# EAGLE design F-rev04 (EAGLE 9.6.2)
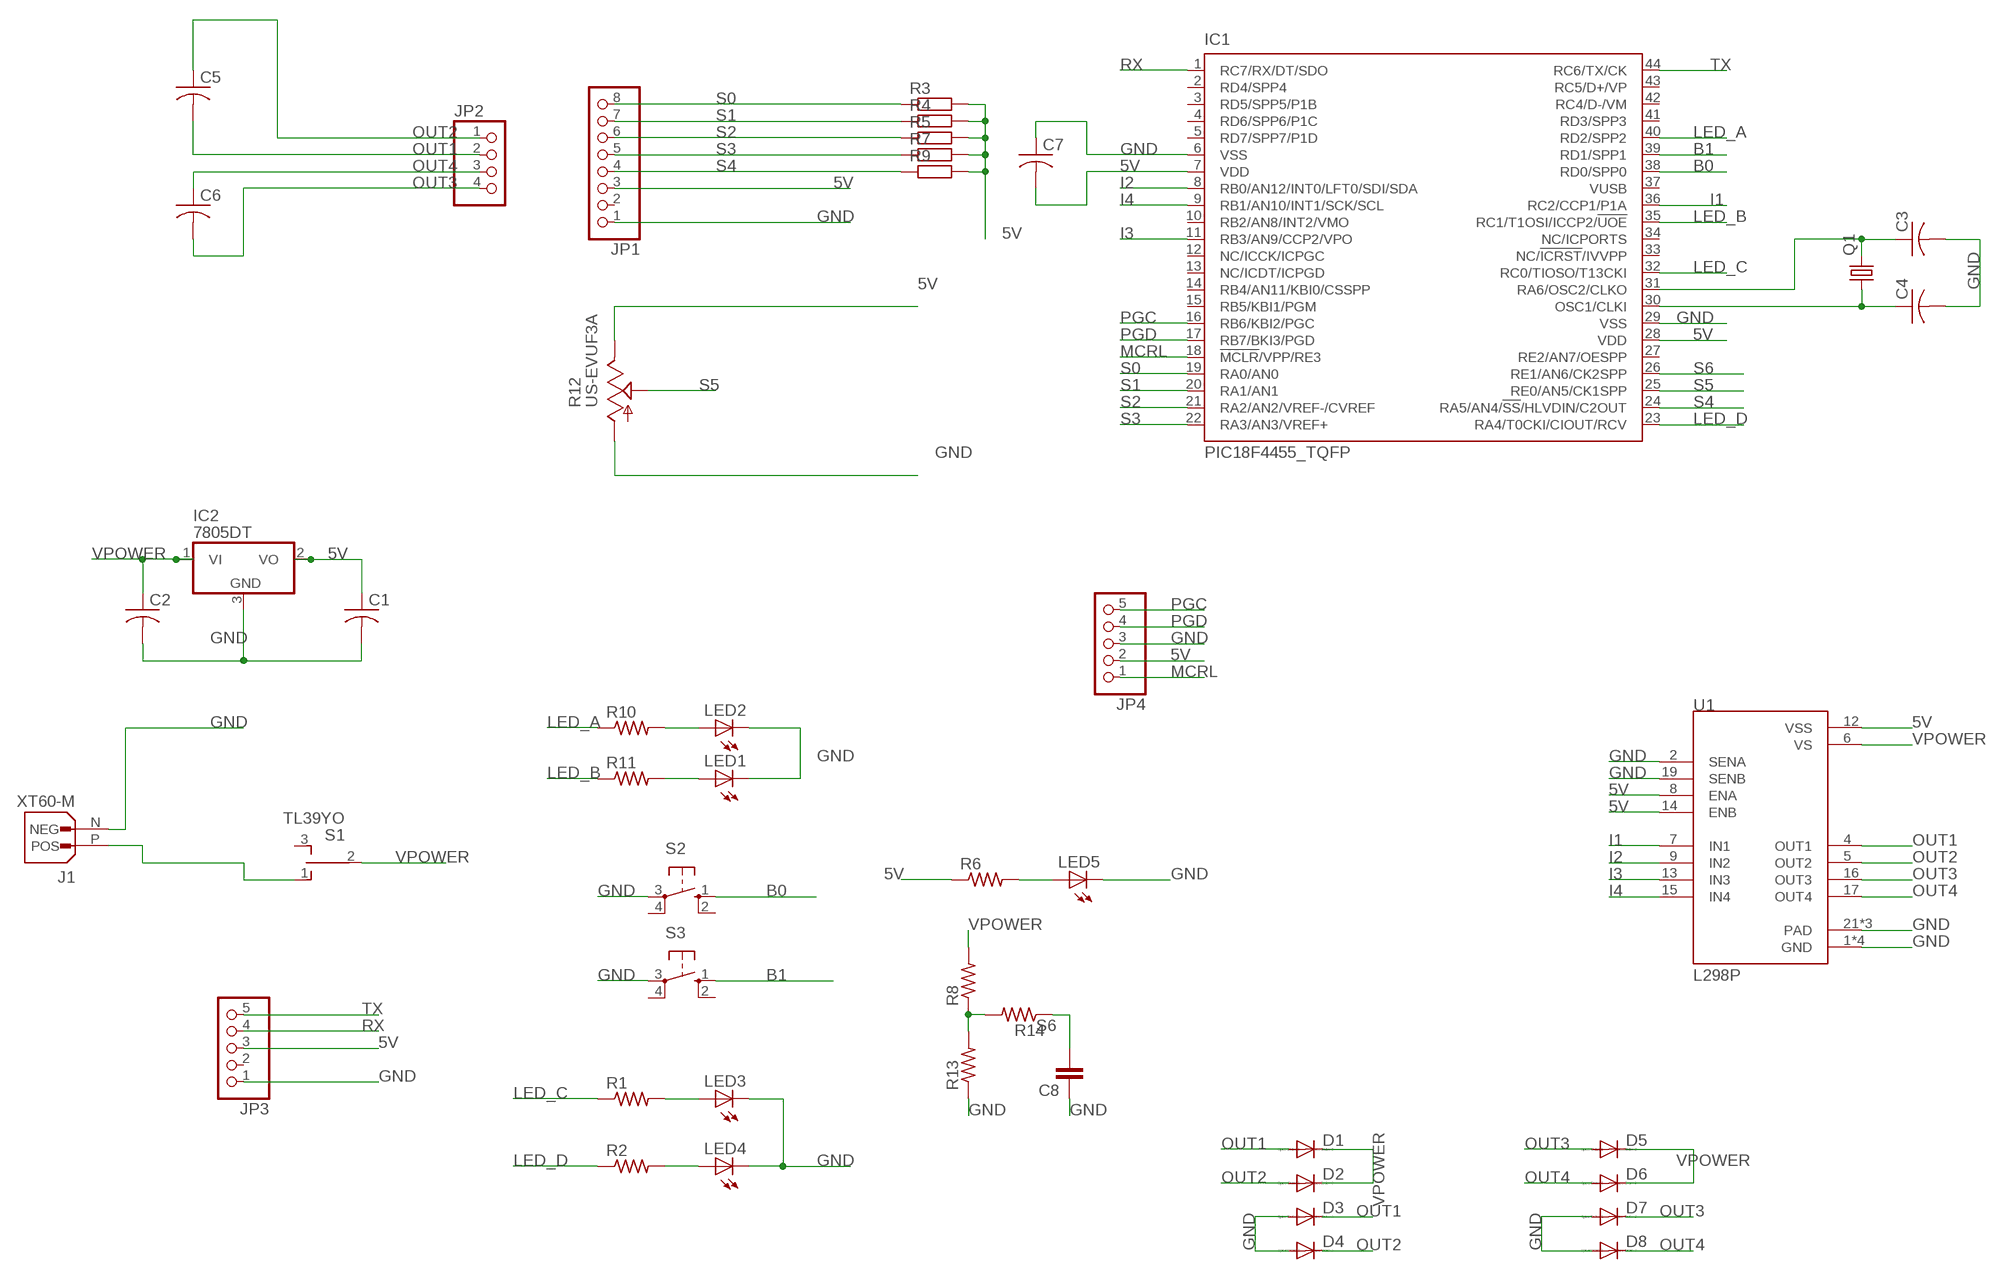
[diagram p0: schematic, sheet 1]

## Parts
C1  C-USC0805K  [C0805K]
C2  C-USC0805K  [C0805K]
C3  C-USC0805K  [C0805K]
C4  C-USC0805K  [C0805K]
C5  C-USC0805K  [C0805K]
C6  C-USC0805K  [C0805K]
C7  C-USC0805K  [C0805K]
C8  C2,5-3  [C2.5-3]
D1  DIODE-DO214AC  [DO214AC]
D2  DIODE-DO214AC  [DO214AC]
D3  DIODE-DO214AC  [DO214AC]
D4  DIODE-DO214AC  [DO214AC]
D5  DIODE-DO214AC  [DO214AC]
D6  DIODE-DO214AC  [DO214AC]
D7  DIODE-DO214AC  [DO214AC]
D8  DIODE-DO214AC  [DO214AC]
IC1  PIC18F4455_TQFP  [TQFP44]
IC2  7805DT  [TO252]
J1  XT60-M  [AMASS_XT60-M]
JP1  PINHD-1X8  [1X08]
JP2  PINHD-1X4  [1X04]
JP3  PINHD-1X5  [1X05]
JP4  PINHD-1X5  [1X05]
LED1  LEDCHIPLED_1206  [CHIPLED_1206]
LED2  LEDCHIPLED_1206  [CHIPLED_1206]
LED3  LEDCHIPLED_1206  [CHIPLED_1206]
LED4  LEDCHIPLED_1206  [CHIPLED_1206]
LED5  LEDCHIPLED_1206  [CHIPLED_1206]
Q1  CRYSTALHC49S  [HC49/S]
R1  R-US_R0805  [R0805]
R2  R-US_R0805  [R0805]
R3  R-EU_M0805  [M0805]
R4  R-EU_M0805  [M0805]
R5  R-EU_M0805  [M0805]
R6  R-US_M0805  [M0805]
R7  R-EU_M0805  [M0805]
R8  R-US_M0805  [M0805]
R9  R-EU_M0805  [M0805]
R10  R-US_M0805  [M0805]
R11  R-US_M0805  [M0805]
R12  US-EVUF3A  [EVUF]
R13  R-US_M0805  [M0805]
R14  R-US_M0805  [M0805]
S1  TL39YO  [TL3XYO]
S2  10-XX  [B3F-10XX]
S3  10-XX  [B3F-10XX]
U1  L298P  [SOIC127P1420X360-20N]

## Nets
5V: C1.1 C7.2 IC1.7(VDD) IC1.28(VDD) IC2.2(VO) JP1.3 JP3.3 JP4.2 R3.2 R4.2 R5.2 R6.1 R7.2 R9.2 R12.3(E) U1.8(ENA) U1.12(VSS) U1.14(ENB)
B0: IC1.38(RD0/SPP0) S2.1(S)
B1: IC1.39(RD1/SPP1) S3.1(S)
GND: C1.2 C2.2 C3.2 C4.2 C7.1 C8.1 D3.A D4.A D7.A D8.A IC1.6(VSS) IC1.29(VSS) IC2.3(GND) J1.N(NEG) JP1.1 JP3.1 JP4.3 LED1.C LED2.C LED3.C LED4.C LED5.C R12.1(A) R13.1 S2.3(P) S3.3(P) U1.1(GND) U1.2(SENA) U1.10(GND) U1.11(GND) U1.19(SENB) U1.20(GND) U1.21(PAD) U1.22(PAD) U1.23(PAD)
I1: IC1.36(RC2/CCP1/P1A) U1.7(IN1)
I2: IC1.8(RB0/AN12/INT0/LFT0/SDI/SDA) U1.9(IN2)
I3: IC1.11(RB3/AN9/CCP2/VPO) U1.13(IN3)
I4: IC1.9(RB1/AN10/INT1/SCK/SCL) U1.15(IN4)
LED_A: IC1.40(RD2/SPP2) R10.1
LED_B: IC1.35(RC1/T1OSI/ICCP2/!UOE) R11.1
LED_C: IC1.32(RC0/TIOSO/T13CKI) R1.1
LED_D: IC1.23(RA4/T0CKI/CIOUT/RCV) R2.1
MCRL: IC1.18(!MCLR!/VPP/RE3) JP4.1
N$17: C4.1 IC1.30(OSC1/CLKI) Q1.1
N$18: C3.1 IC1.31(RA6/OSC2/CLKO) Q1.2
N$19: R8.1 R13.2 R14.2
N$20: LED2.A R10.2
N$21: LED1.A R11.2
N$24: LED3.A R1.2
N$25: LED4.A R2.2
N$26: LED5.A R6.2
OUT1: C5.2 D1.A D3.C JP2.2 U1.4(OUT1)
OUT2: C5.1 D2.A D4.C JP2.1 U1.5(OUT2)
OUT3: C6.2 D5.A D7.C JP2.4 U1.16(OUT3)
OUT4: C6.1 D6.A D8.C JP2.3 U1.17(OUT4)
PGC: IC1.16(RB6/KBI2/PGC) JP4.5
PGD: IC1.17(RB7/BKI3/PGD) JP4.4
RX: IC1.1(RC7/RX/DT/SDO) JP3.4
S0: IC1.19(RA0/AN0) JP1.8 R3.1
S1: IC1.20(RA1/AN1) JP1.7 R4.1
S2: IC1.21(RA2/AN2/VREF-/CVREF) JP1.6 R5.1
S3: IC1.22(RA3/AN3/VREF+) JP1.5 R7.1
S4: IC1.24(RA5/AN4/!SS!/HLVDIN/C2OUT) JP1.4 R9.1
S5: IC1.25(RE0/AN5/CK1SPP) R12.2(S)
S6: C8.2 IC1.26(RE1/AN6/CK2SPP) R14.1
TX: IC1.44(RC6/TX/CK) JP3.5
VPOWER: C2.1 D1.C D2.C D5.C D6.C IC2.1(VI) R8.2 S1.2(P) U1.6(VS)
VPREV: J1.P(POS) S1.1(O)
Unconnected: IC1.2(RD4/SPP4) IC1.3(RD5/SPP5/P1B) IC1.4(RD6/SPP6/P1C) IC1.5(RD7/SPP7/P1D) IC1.10(RB2/AN8/INT2/VMO) IC1.12(NC/ICCK/ICPGC) IC1.13(NC/ICDT/ICPGD) IC1.14(RB4/AN11/KBI0/CSSPP) IC1.15(RB5/KBI1/PGM) IC1.27(RE2/AN7/OESPP) IC1.33(NC/!ICRST!/IVVPP) IC1.34(NC/ICPORTS) IC1.37(VUSB) IC1.41(RD3/SPP3) IC1.42(RC4/D-/VM) IC1.43(RC5/D+/VP) JP1.2 JP3.2 S1.3(S) S2.2(S1) S2.4(P1) S3.2(S1) S3.4(P1)

## Library data of the parts
C1-C7 = adafruit:C-US: CAPACITOR, American symbol
C8 = capacitor-wima:C: CAPACITOR naming: grid - package width
D1-D8 = diode:DIODE-: DIODE
IC1 = microchip:PIC18F4*_TQFP: USB Microcontrollers with nanoWatt Technology High-Performance, Enhanced Flash, 28/40/44-Pin, Source: http://ww1.microchip.com/downloads/en/devicedoc/39632c.pdf; MF: MICROCHIP; MPN: PIC18F4455-I/PT; OC_FARNELL: 9321322; OC_NEWARK: 08J9628
IC2 = linear:78*: Positive VOLTAGE REGULATOR Source: http://cache.national.com/ds/LM/LM78L05.pdf http://www.fairchildsemi.com/ds/LM/LM7805.pdf
J1 = XT60-M:XT60-M: Check availability <https://pricing.snapeda.com/parts/XT60-M/AMASS/view-part?ref=eda>; AVAILABILITY: Not in stock; CHECK_PRICES: https://www.snapeda.com/parts/XT60-M/AMASS/view-part/?ref=eda; DESCRIPTION: Plug; DC supply; XT60; male; PIN: 2; for cable; soldered; 30A; 500V; MF: AMASS; MP: XT60-M; PACKAGE: Package; PRICE: None; SNAPEDA_LINK: https://www.snapeda.com/parts/XT60-M/AMASS/view-part/?ref=snap
JP1 = pinhead:PINHD-1X8: PIN HEADER
JP2 = pinhead:PINHD-1X4: PIN HEADER
JP3 JP4 = pinhead:PINHD-1X5: PIN HEADER
LED1-LED5 = adafruit:LED: LED OSRAM: - CHIPLED LG R971, LG N971, LY N971, LG Q971, LY Q971, LO R971, LY R971 LH N974, LH R974 LS Q976, LO Q976, LY Q976 LO Q996 - Hyper CHIPLED LW Q18S LB Q993, LB Q99A, LB R99A - SideLED LS A670, LO A670, LY A670, LG A670, LP A670 LB A673, LV A673, LT A673, LW A673 LH A674 LY A675 LS A676, LA A676, LO A676, LY A676, LW A676 LS A679, LY A679, LG A679 - Hyper Micro SIDELED® LS Y876, LA Y876, LO Y876, LY Y876 LT Y87S - SmartLED LW L88C, LW L88S LB L89C, LB L89S, LG L890 LS L89K, LO L89K, LY L89K LS L896, LA L896, LO L896, LY L896 - TOPLED LS T670, LO T670, LY T670, LG T670, LP T670 LSG T670, LSP T670, LSY T670, LOP T670, LYG T670 LG T671, LOG T671, LSG T671 LB T673, LV T673, LT T673, LW T673 LH T674 LS T676, LA T676, LO T676, LY T676, LB T676, LH T676, LSB T676, LW T676 LB T67C, LV T67C, LT T67C, LS T67K, LO T67K, LY T67K, LW E67C LS E67B, LA E67B, LO E67B, LY E67B, LB E67C, LV E67C, LT E67C LW T67C LS T679, LY T679, LG T679 LS T770, LO T770, LY T770, LG T770, LP T770 LB T773, LV T773, LT T773, LW T773 LH T774 LS E675, LA E675, LY E675, LS T675 LS T776, LA T776, LO T776, LY T776, LB T776 LHGB T686 LT T68C, LB T68C - Hyper Mini TOPLED® LB M676 - Mini TOPLED Santana® LG M470 LS M47K, LO M47K, LY M47K Source: http://www.osram.convergy.de/
Q1 = crystal:CRYSTAL: CRYSTAL; OC_FARNELL: 1667008; OC_NEWARK: unknown
R1 R2 = resistor:R-US_: RESISTOR, American symbol
R3-R5 R7 R9 = resistor:R-EU_: RESISTOR, European symbol
R6 R8 R10 R11 R13 R14 = adafruit:R-US_: RESISTOR, American symbol
R12 = pot:US-EVU: 9 mm Square Rotary Potentiometers Source: Panasonic
S1 = switch:TL39YO: TINY SWITCH ON OFF ON Source: http://www2.produktinfo.conrad.com/datenblaetter/700000-724999/705152-da-01-de-Subminiaturschalter_TL_36YO.pdf
S2 S3 = switch-omron:10-XX: OMRON SWITCH; MPN: B3F-1000; OC_FARNELL: 176432; OC_NEWARK: 36M3542
U1 = L298P:L298P: L298 Series Dual Full Bridge 4 A 46 V Driver Surface Mount - PowerSO-20 Check availability <https://pricing.snapeda.com/parts/L298P/STMicroelectronics/view-part?ref=eda>; AVAILABILITY: In Stock; CHECK_PRICES: https://www.snapeda.com/parts/L298P/STMicroelectronics/view-part/?ref=eda; DESCRIPTION: Half Bridge (4) Driver DC Motors, Relays, Solenoids, Stepper Motors Bipolar PowerSO-20; MF: STMicroelectronics; MP: L298P; PACKAGE: SO-20 STMicroelectronics; PRICE: None; PURCHASE-URL: https://www.snapeda.com/api/url_track_click_mouser/?unipart_id=41344&manufacturer=STMicroelectronics&part_name=L298P&search_term=None; SNAPEDA_LINK: https://www.snapeda.com/parts/L298P/STMicroelectronics/view-part/?ref=snap

## Board
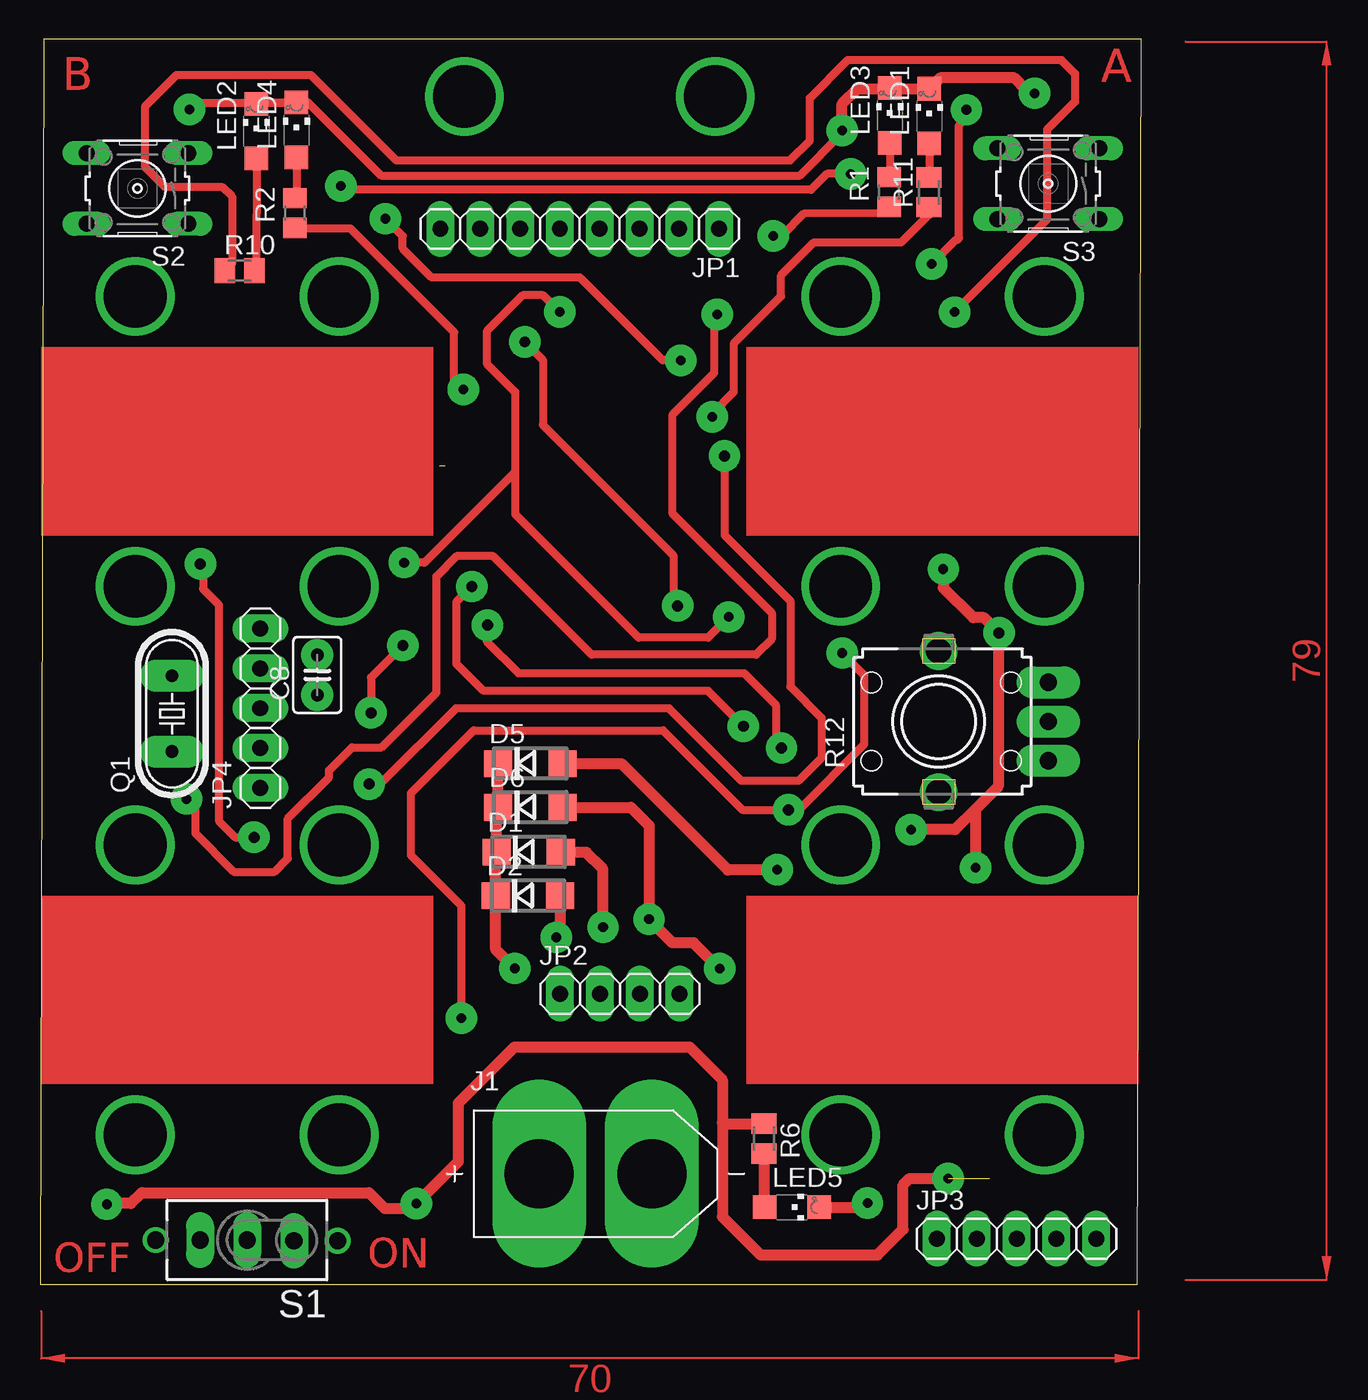
[diagram p1: board, top side]
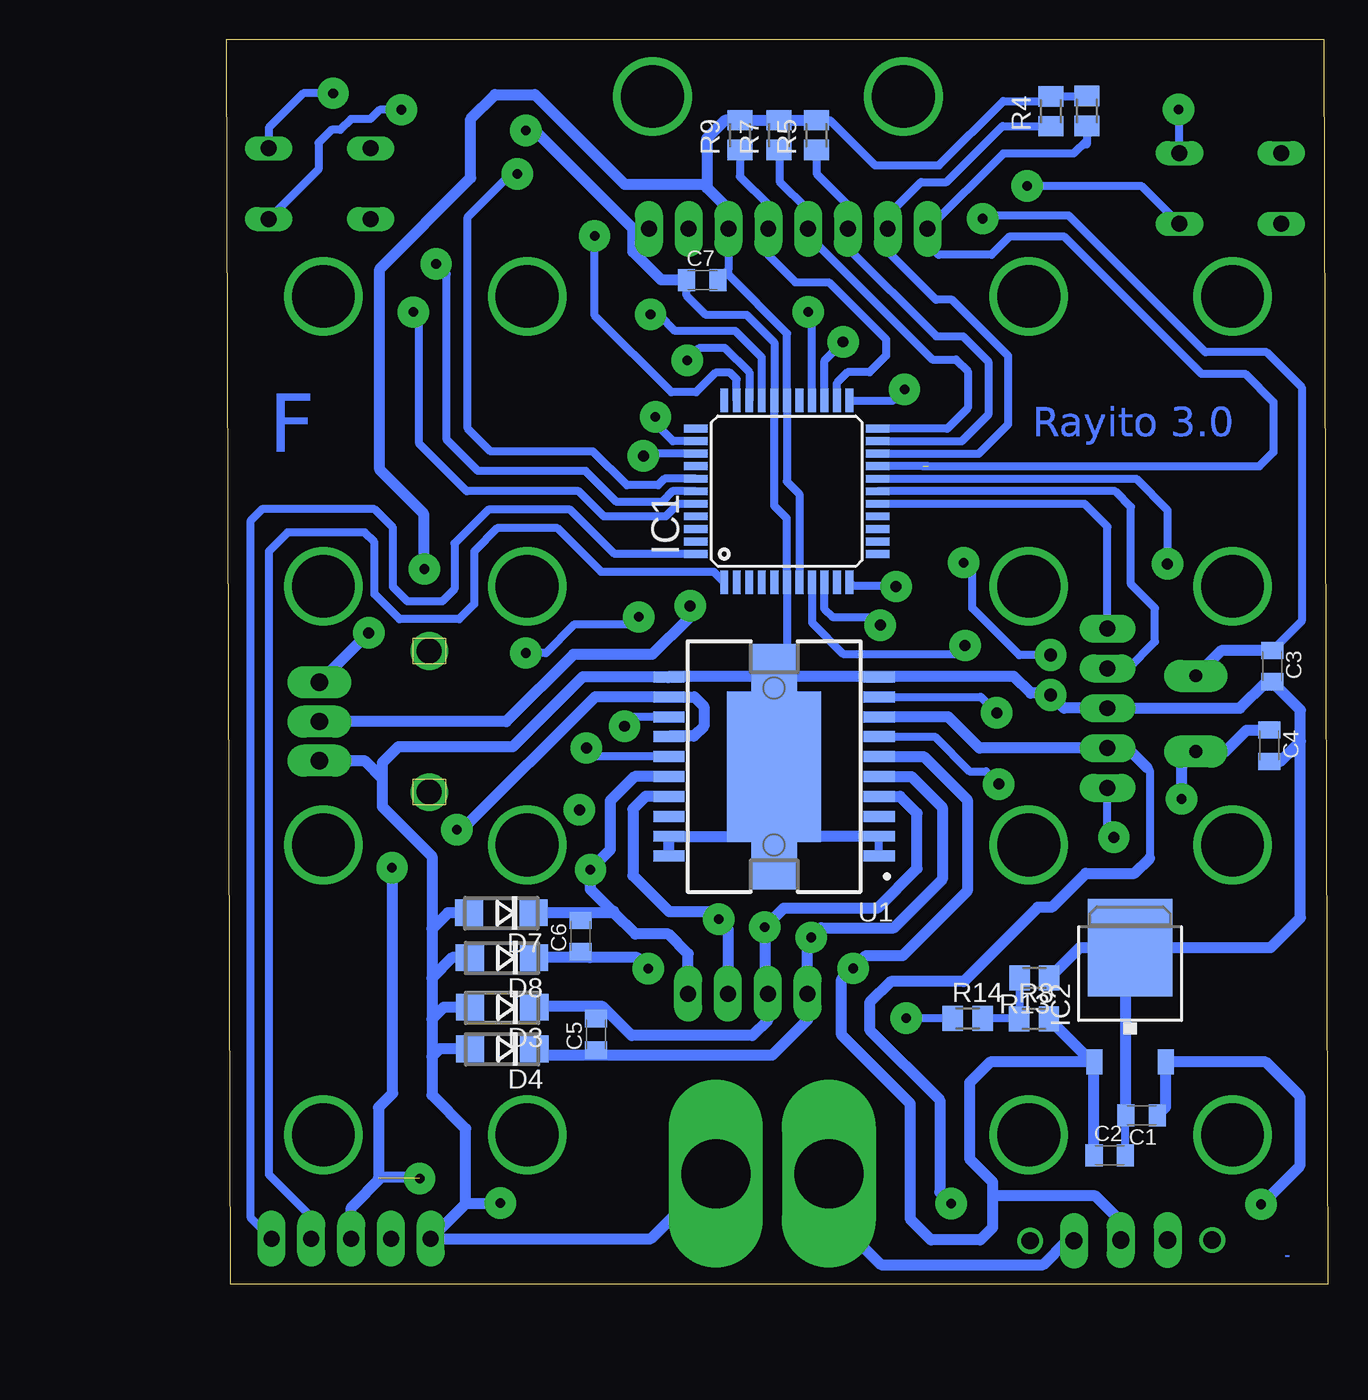
[diagram p2: board, bottom side, seen from below]

Size 70.24 x 79.43 mm. Coordinates in mm from the lower left corner, seen from the top.
Outline: 70,0 70.24,79.43 0.24,79.43 0,0 70,0
Copper layers (1*16): Top 0.035mm / dielectric 1.5mm / Bottom 0.035mm
Design rules "default *": minimum track width 10mil, minimum drill 24mil, track to track 8mil, track to pad 8mil, pad to pad 8mil, via to via 8mil, smd to smd 8mil, copper to edge 40mil, drill to drill 8mil, minimum pad ring 10mil, minimum via ring 0.4mm, stop-mask expansion 4mil, vias tented up to drill 0mil, thermal gap 10mil

### Footprints (pad centres in the part's own frame; a part is rotated, then mirrored left to right if it is on the bottom)
C0805K = smd 1.1 x 1.4: 1 -1,0; 2 1,0
C2.5-3 = drill 0.813 pad 2.032: 1 -1.27,0; 2 1.27,0
DO214AC = smd 1.8 x 1.7: A 2.05,0; C -2.05,0
TQFP44 = smd 1.5 x 0.5: 1 -5.8,4; 2 -5.8,3.2; 3 -5.8,2.4; 4 -5.8,1.6; 5 -5.8,0.8; 6 -5.8,0; 7 -5.8,-0.8; 8 -5.8,-1.6; 9 -5.8,-2.4; 10 -5.8,-3.2; 11 -5.8,-4; 23 5.8,-4; 24 5.8,-3.2; 25 5.8,-2.4; 26 5.8,-1.6; 27 5.8,-0.8; 28 5.8,0; 29 5.8,0.8; 30 5.8,1.6; 31 5.8,2.4; 32 5.8,3.2; 33 5.8,4 | smd 0.5 x 1.5: 12 -4,-5.8; 13 -3.2,-5.8; 14 -2.4,-5.8; 15 -1.6,-5.8; 16 -0.8,-5.8; 17 0,-5.8; 18 0.8,-5.8; 19 1.6,-5.8; 20 2.4,-5.8; 21 3.2,-5.8; 22 4,-5.8; 34 4,5.8; 35 3.2,5.8; 36 2.4,5.8; 37 1.6,5.8; 38 0.8,5.8; 39 0,5.8; 40 -0.8,5.8; 41 -1.6,5.8; 42 -2.4,5.8; 43 -3.2,5.8; 44 -4,5.8
TO252 = smd 1 x 1.6: 1 -2.28,-4.8; 2 2.28,-4.8 | smd 5.4 x 6.2: 3 0,2.5
AMASS_XT60-M = drill 4.401 pad 6 long: N 3.6,0 | drill 4.401 pad 5.994 long: P -3.6,0
1X08 = drill 1.016 pad 1.778 long: 1 -8.89,0; 2 -6.35,0; 3 -3.81,0; 4 -1.27,0; 5 1.27,0; 6 3.81,0; 7 6.35,0; 8 8.89,0
1X04 = drill 1.016 pad 1.778 long: 1 -3.81,0; 2 -1.27,0; 3 1.27,0; 4 3.81,0
1X05 = drill 1.016 pad 1.778 long: 1 -5.08,0; 2 -2.54,0; 3 0,0; 4 2.54,0; 5 5.08,0
CHIPLED_1206 = smd 1.5 x 1.5: A 0,-1.75; C 0,1.75
HC49/S = drill 0.813 pad 2.032 long: 1 -2.413,0; 2 2.413,0
R0805 = smd 1.3 x 1.5: 1 -0.95,0; 2 0.95,0
M0805 = smd 1.3 x 1.6: 1 -0.95,0; 2 0.95,0
EVUF = drill 1.1 pad 2.032 long: 1 -2.5,-7; 2 0,-7; 3 2.5,-7 | drill 1.6 pad 2.032: M1 4.5,0; M2 -4.5,0
TL3XYO = drill 1.1 pad 1.778 long: 1 -2.99,0.05; 2 0,0; 3 2.99,0 | drill 1.1 pad 1.524: M1 -5.78,0.05; M2 5.83,0
B3F-10XX = drill 1.016 long: 1 -3.251,2.261; 2 3.251,2.261; 3 -3.251,-2.261; 4 3.251,-2.261
SOIC127P1420X360-20N = smd 2 x 0.7: 1 -6.7,5.715; 2 -6.7,4.445; 3 -6.7,3.175; 4 -6.7,1.905; 5 -6.7,0.635; 6 -6.7,-0.635; 7 -6.7,-1.905; 8 -6.7,-3.175; 9 -6.7,-4.445; 10 -6.7,-5.715; 11 6.7,-5.715; 12 6.7,-4.445; 13 6.7,-3.175; 14 6.7,-1.905; 15 6.7,-0.635; 16 6.7,0.635; 17 6.7,1.905; 18 6.7,3.175; 19 6.7,4.445; 20 6.7,5.715 | smd 6 x 9.6: 21 0,0 | smd 2.9 x 3.05: 22 0,6.3; 23 0,-6.3

### Placement (x,y rotation side)
C1  11.87,10.77 180 bottom
C2  13.91,8.23 0 bottom
C3  3.54,39.43 270 bottom
C4  3.72,34.36 270 bottom
C5  46.67,15.94 90 bottom
C6  47.67,22.22 90 bottom
C7  39.9,64.06 0 bottom
C8  17.68,38.87 90 top
D1  31.17,27.56 0 top
D2  31.12,24.78 0 top
D3  52.67,17.67 180 bottom
D4  52.67,15.02 180 bottom
D5  31.27,33.21 0 top
D6  31.27,30.42 0 top
D7  52.72,23.7 180 bottom
D8  52.68,20.84 180 bottom
IC1  34.5,50.59 90 bottom
IC2  12.61,18.98 0 bottom
J1  35.43,7.05 0 top
JP1  34.42,67.33 180 top
JP2  36.99,18.53 0 top
JP3  62.3,2.91 0 top
JP4  14.05,36.75 90 top
LED1  56.73,74.52 0 top
LED2  13.8,73.56 0 top
LED3  54.21,74.56 0 top
LED4  16.36,73.63 0 top
LED5  47.96,4.92 270 top
Q1  8.41,36.4 90 top
R1  54.16,69.68 90 top
R2  16.25,68.34 90 top
R3  15.37,74.85 90 bottom
R4  17.65,74.83 90 bottom
R5  32.61,73.31 90 bottom
R6  46.19,9.29 270 top
R7  35,73.31 90 bottom
R8  18.74,16.94 0 bottom
R9  37.5,73.31 90 bottom
R10  12.73,64.67 0 top
R11  56.7,69.66 90 top
R12  57.32,35.9 90 top
R13  18.71,19.54 180 bottom
R14  22.97,16.97 0 bottom
S1  13.2,2.82 180 top
S2  6.21,69.91 180 top
S3  64.31,70.21 180 top
U1  35.32,33.03 180 bottom

### Tracks (layer width: path | path; a pad name or v marks a point on that pad's centre or on a via)
5V  (via drill 0.61 pad 2, 0.7 pad 2)  (1 unrouted)
  Top 0.5: 61.13,41.62 61.13,41.6 v61.17,41.56
  Top 0.7: 43.53,10.3 43.53,13.04 41.44,15.13 30.26,15.13 26.69,11.56 26.69,7.84 v24.01,5.16 23.69,4.84 21.99,4.84 20.98,5.85 6.49,5.85 5.79,5.15 4.3,5.15 v4.25,5.1 | 43.53,10.3 43.53,4.32 45.97,1.88 53.43,1.88 55.05,3.5 55.05,6.34 55.46,6.75 v57.93,6.75 | v61.17,41.56 60.21,42.52 59.53,42.52 57.62,44.43 v57.62,45.63 | 61.13,41.62 61.13,31.76 59.66,30.29 | 59.66,30.29 59.66,26.61 v59.69,26.58 | 59.66,30.29 58.37,29 v55.56,29 | 43.53,10.3 43.59,10.24 R6.1
  Bottom 0.5: IC1.7 33.7,50.41 34.5,51.21 IC1.28 34.48,56.4 34.48,60.66 38.23,64.4 38.23,64.73 | 11.52,32.95 11.36,32.79 11.36,27.17 | JP1.3 38.23,65.85 | R4.2 17.63,75.8 R3.2 | 38.31,67.25 JP1.3 | R5.2 31.74,74.26 28.87,71.39 24.79,71.39 20.7,75.48 17.95,75.48 | JP1.3 38.23,64.73 | 38.23,64.73 C7.2
  Bottom 0.7: 11.52,32.95 12.78,34.21 JP4.2 | U1.8 24.21,36.2 22.21,34.21 JP4.2 | 14.11,34.15 JP4.2 | JP1.3 38.23,68.58 39.6,69.95 | 32.65,74.3 R5.2 R7.2 R9.2 38.45,74.26 39.6,73.11 39.6,69.95 | 39.6,69.95 39.82,70.17 44.85,70.17 50.58,75.9 53.12,75.9 54.67,74.35 54.67,70.58 60.48,64.77 60.48,51.96 57.69,49.17 57.69,45.7 v57.62,45.63 | U1.14 41.98,34.97 40.43,34.97 39.8,35.6 39.8,36.87 40.41,37.48 U1.12 46.73,37.48 55.21,29 v55.56,29 | v4.25,5.1 4.17,5.18 4.14,5.18 1.79,7.53 1.79,12.01 3.96,14.18 IC2.2 | v59.69,26.58 59.65,26.58 59.64,26.57 59.64,12.19 60.55,11.28 60.55,6.76 | R12.3 v61.17,41.56 | 11.36,27.17 12.32,26.21 15.44,26.21 17.6,24.05 18.49,24.05 23.22,19.32 27.87,19.32 29.22,17.97 29.22,16.23 24.74,11.75 24.74,5.89 v24.01,5.16 24.69,5.84 | IC2.2 | JP3.3 62.3,4.89 60.38,6.81 57.99,6.81 v57.93,6.75 | 17.95,75.48 R4.2 | C1.1 10.33,11.31 IC2.2
B0  (via drill 0.61 pad 2)
  Top 0.5: v51.7,70.84 50.2,70.84 49.18,69.82 19.44,69.82 v19.18,70.08
  Bottom 0.5: IC1.38 42.29,51.39 42.71,50.97 44.71,50.97 46.87,53.13 53.39,53.13 54.86,54.6 54.86,68.08 52.1,70.84 v51.7,70.84 | v19.18,70.08 11.89,70.08 S2.1
B1  (via drill 0.61 pad 2)
  Top 0.5: v56.88,65.09 58.4,66.61 58.49,66.61 58.62,66.74 58.62,73.95 59.09,74.42 v59.09,74.93
  Bottom 0.5: IC1.39 41.8,50.59 42.48,49.91 45.36,49.91 47.33,51.88 54.21,51.88 56.21,53.88 56.21,64.45 56.85,65.09 v56.88,65.09 | v59.09,74.93 60.48,74.93 61.08,74.33 62.31,74.33 62.99,73.65 63.55,73.65 64.38,72.82 64.38,71.13 S3.1
GND  (via drill 0.61 pad 2)
  Top 0.5: v9.52,74.94 9.96,75.38 LED4.C | LED4.C 13.87,75.38 LED2.C | LED4.C 17.11,75.38 21.76,70.73 48.47,70.73 51.16,73.42 v51.16,73.61 | LED3.C 56.69,76.31 LED1.C
  Top 0.7: LED1.C 56.55,76.45 | v51.16,73.61 51.16,75.3 52.13,76.27 LED1.C | LED1.C 57.43,76.97 62.14,76.97 62.9,76.21 63.22,76.21 v63.45,75.98 | LED5.C 52.51,4.92 v52.78,5.19
  Bottom 0.5: U1.1 U1.2 | 34.5,39.77 IC1.6 34.5,48.85 35.3,49.65 IC1.29 35.3,60.08 37.06,61.84 39.66,61.84 40.9,63.08 C7.1 | 34.5,39.77 34.5,39.34 35.06,38.78 | v9.52,74.94 9.55,74.91 9.46,74.82 S2.3 | S3.3 67.56,73.78 65.36,75.98 v63.45,75.98 | U1.23 34.88,39.77 34.5,39.77 | C8.1 17.68,37.98 | 12.91,11.06 12.87,11.02 C1.2 12.91,10.73 C2.2
  Bottom 0.7: 1.74,34.64 1.74,36.64 C3.2 3.92,38.43 5.6,36.75 JP4.3 16.83,36.75 C8.1 17.79,37.71 18.95,37.71 20.02,38.78 28.66,38.78 | 28.6,38.79 28.62,38.77 U1.10 28.66,38.78 | U1.20 U1.19 35.52,28.59 | JP3.1 56.95,2.64 | R12.1 61.44,33.4 60.32,32.28 | 60.32,32.28 60.32,30.47 57.15,27.3 57.15,22.68 | U1.11 41.98,38.78 35.06,38.78 28.66,38.78 | U1.2 35.12,28.59 35.32,28.78 | 35.32,28.78 35.82,28.78 | 35.52,28.59 35.32,28.78 | J1.N 43.17,2.91 JP3.1 | U1.11 42.06,38.7 | 60.32,32.28 60.32,33.26 59.3,34.28 52,34.28 47.54,38.75 U1.11 | JP3.1 54.99,5.14 | 54.99,5.14 54.99,9.92 57.15,12.07 57.15,14.53 | IC2.3 3.64,21.48 1.74,23.38 1.74,34.64 | 57.15,22.68 57.15,19.54 | 57.15,19.54 57.15,16.92 | 57.15,16.92 57.15,14.53 | 44.32,67.33 50.6,73.61 v51.16,73.61 | IC2.3 12.91,21.18 | U1.22 35.06,26.99 | U1.23 U1.21 U1.22 | U1.22 35.32,28.39 35.52,28.59 | v52.78,5.19 52.83,5.14 54.99,5.14 | R13.1 15.82,21.48 IC2.3 | D7.A 56.12,23.7 57.15,22.68 | D8.A 55.84,20.84 57.15,19.54 | D3.A 56.4,17.67 57.15,16.92 | D4.A 56.66,15.02 57.15,14.53 | C1.2 12.87,21.22 IC2.3 | JP1.1 44.32,67.33 | 44.32,67.33 44.32,65.87 42.51,64.06 C7.1 | C4.2 3.02,33.36 1.74,34.64
I1  (via drill 0.7 pad 2)
  Top 0.5: 21.12,32.09 20.99,31.96 v20.99,31.91 21.7,31.91 26.53,36.74 40.12,36.74 44.74,32.12 48.39,32.12 49.85,33.58 49.85,36.14 47.86,38.13 47.86,43.59 43.66,47.79 v43.66,52.84
  Bottom 0.5: U1.7 25.07,34.94 22.85,32.72 21.8,32.72 v20.99,31.91 | IC1.36 43.66,52.99 v43.66,52.84
I2  (via drill 0.7 pad 2)
  Top 0.5: v23.14,40.75 21.11,38.72 v21.11,36.45
  Bottom 0.5: IC1.8 32.9,42.2 30.91,40.21 23.68,40.21 v23.14,40.75 | U1.9 22.14,37.48 v21.11,36.45
I3  (via drill 0.7 pad 2)
  Top 0.5: v44.86,35.6 42.61,37.85 28.29,37.85 26.55,39.59 26.55,43.52 v27.54,44.51
  Bottom 0.5: U1.13 44.26,36.2 v44.86,35.6 | v27.54,44.51 27.6,44.57 30.28,44.57 IC1.11
I4  (via drill 0.7 pad 2)
  Top 0.5: v47.29,34.21 46.94,34.56 46.94,36.96 44.91,38.99 30.51,38.99 28.49,41.01 28.49,42 v28.54,42.05
  Bottom 0.5: v28.54,42.05 29.06,42.57 31.61,42.57 32.1,43.06 IC1.9 | U1.15 46.74,33.66 v47.29,34.21
LED_A  (via drill 0.61 pad 2)
  Top 0.5: R10.1 12.24,65.13 12.24,69.4 11.66,69.98 7.99,69.98 6.71,71.26 6.71,75.16 8.69,77.14 17.28,77.14 22.72,71.7 47.85,71.7 49.1,72.95 49.1,75.68 51.51,78.09 65.16,78.09 66.02,77.23 66.02,75.44 64.24,73.66 64.24,67.92 v58.34,62.02
  Bottom 0.5: IC1.40 41.43,49.79 42.24,48.98 46.17,48.98 47.78,50.59 54.92,50.59 57.95,53.62 57.95,61.63 v58.34,62.02
LED_B  (via drill 0.61 pad 2)
  Top 0.5: v42.88,55.35 42.88,55.56 44.25,56.92 44.25,60.01 47.27,63.03 47.27,64.37 49.37,66.47 54.94,66.47 56.7,68.23 R11.1
  Bottom 0.5: IC1.35 41.77,53.79 42.88,54.9 v42.88,55.35
LED_C  (via drill 0.61 pad 2)
  Top 0.5: v46.77,66.89 47.31,66.89 48.71,68.29 53.76,68.33 R1.1
  Bottom 0.5: IC1.32 37.7,57.73 38.12,58.15 39.04,58.15 40.29,56.9 41.87,56.9 46.77,61.8 v46.77,66.89
LED_D  (via drill 0.61 pad 2)
  Top 0.5: R2.1 16.28,67.36 19.79,67.36 26.41,60.74 26.41,57.69 v27,57.1
  Bottom 0.5: IC1.23 27.71,56.39 v27,57.1
MCRL  (via drill 0.7 pad 2)
  Top 0.5: v10.22,45.96 10.39,45.79 10.39,44.36 11.39,43.36 11.39,29.57 12.44,28.52 v13.64,28.52
  Bottom 0.5: v10.22,45.96 10.22,49.39 12.22,51.39 IC1.18 | v13.64,28.52 14.05,28.93 JP4.1
N$1  (via drill 4 pad 5)
  other vias: 19.07,63.03
N$2  (via drill 4 pad 5)
  other vias: 6.07,63.03
N$3  (via drill 4 pad 5)
  other vias: 6.07,28.03
N$4  (via drill 4 pad 5)
  other vias: 6.07,9.53
N$5  (via drill 4 pad 5)
  other vias: 19.07,44.53
N$6  (via drill 4 pad 5)
  other vias: 6.07,44.53
N$7  (via drill 4 pad 5)
  other vias: 19.07,9.53
N$8  (via drill 4 pad 5)
  other vias: 19.07,28.03
N$9  (via drill 4 pad 5)
  other vias: 51.07,63.03
N$10  (via drill 4 pad 5)
  other vias: 64.07,63.03
N$11  (via drill 4 pad 5)
  other vias: 51.07,44.53
N$12  (via drill 4 pad 5)
  other vias: 64.07,44.53
N$13  (via drill 4 pad 5)
  other vias: 51.07,28.03
N$14  (via drill 4 pad 5)
  other vias: 51.07,9.53
N$15  (via drill 4 pad 5)
  other vias: 64.07,9.53
N$16  (via drill 4 pad 5)
  other vias: 64.07,28.03
N$17  (via drill 0.61 pad 2)
  Top 0.5: v9.33,30.96 9.9,30.39 9.9,28.78 12.36,26.32 14.96,26.32 15.8,27.16 15.8,29.71 18.43,32.34 18.43,32.79 19.89,34.25 21.78,34.25 25.28,37.75 25.28,45.16 26.6,46.48 28.86,46.48 35.18,40.16 45.68,40.16 46.69,41.16 46.69,42.83 40.35,49.16 40.35,55.49 42.99,58.13 42.99,61.67 v43.2,61.88
  Bottom 0.5: IC1.30 36.1,59.13 37.79,60.82 41.63,60.82 42.69,61.88 v43.2,61.88
  Bottom 0.7: v9.33,30.96 9.33,33.07 Q1.1 6.54,33.99 5.17,35.36 C4.1
N$18  (via drill 0.61 pad 2)
  Top 0.5: v40.86,58.95 39.72,58.95 34.44,64.23 24.98,64.23 23.13,66.08 23.13,66.87 v22.02,67.98
  Bottom 0.5: Q1.2 8.31,38.81 6.82,40.3 | v40.86,58.95 40.06,59.75 38.47,59.75 36.9,58.18 IC1.31 | v22.02,67.98 21.82,68.18 16.52,68.18 7.8,59.46 3.89,59.46 1.66,57.23 1.66,42.31 C3.1
  Bottom 0.7: C3.1 6.79,40.43 Q1.2
N$19
  Bottom 0.5: R13.2 19.66,16.97 R8.1 19.72,16.97 R14.2
N$20
  Top 0.5: LED2.A 13.77,64.76 R10.2
N$21
  Top 0.5: LED1.A 56.73,70.72 56.77,70.68
  Top 0.7: 56.77,70.68 R11.2
N$22  (via drill 4)
  other vias: 27.07,75.78
N$23  (via drill 4)
  other vias: 43.07,75.78
N$24
  Top 0.5: LED3.A 54.21,70.68 R1.2
N$25
  Top 0.5: LED4.A 16.36,69.4 R2.2
N$26
  Top 0.7: R6.2 46.19,4.94 LED5.A
OUT1  (via drill 0.61 pad 2)
  Top 0.7: v35.91,22.79 35.91,26.49 34.84,27.56 D1.A
  Bottom 0.7: U1.4 27.27,31.12 26.2,30.05 26.2,26.52 28.73,23.99 34.71,23.99 v35.91,22.79 35.91,18.72 JP2.2 | JP2.2 35.76,18.49 | JP2.2 35.72,16.85 36.7,15.87 44.41,15.87 46.26,17.72 46.96,17.72 | 46.96,17.72 50.57,17.72 D3.C | 46.96,17.72 46.67,17.43 C5.2
OUT2  (via drill 0.61 pad 2)
  Top 0.7: D2.A 33.17,22.36 v32.94,22.13
  Bottom 0.7: U1.5 26.55,32.39 24.59,30.43 24.59,25.83 27.67,22.75 32.32,22.75 v32.94,22.13 33.23,21.84 33.23,18.58 JP2.1 33.18,16.87 35.43,14.62 46.66,14.62 | D4.C 50.22,14.62 46.66,14.62 | C5.1 46.66,14.62
OUT3  (via drill 0.61 pad 2)
  Top 0.7: D5.A 37.08,33.21 43.87,26.42 46.99,26.42 v47.03,26.46
  Bottom 0.5: C6.2 47.19,23.7 46.88,23.7
  Bottom 0.7: U1.16 44.22,32.39 45.77,30.84 45.77,27.72 v47.03,26.46 47.03,25.2 45.53,23.7 | 45.53,23.7 44.17,22.34 42.06,22.34 40.8,21.08 JP2.4 | 45.53,23.7 46.88,23.7 D7.C | 45.53,23.79 45.53,23.7
OUT4  (via drill 0.61 pad 2)
  Top 0.7: v43.35,20.13 41.69,21.79 40.34,21.79 v38.84,23.29 38.84,29.26 37.68,30.42 D6.A
  Bottom 0.5: C6.1 47.29,20.84 47.07,20.84
  Bottom 0.7: U1.17 43.51,31.12 44.32,30.31 44.32,26.08 42.02,23.78 39.34,23.78 v38.84,23.29 38.26,22.7 JP2.3 38.3,18.49 | v43.35,20.13 44.06,20.84 47.07,20.84 D8.C
PGC
  Bottom 0.5: JP4.5 14.05,48.33 15.51,49.79 IC1.16
PGD
  Bottom 0.5: JP4.4 12.72,39.29 11.02,40.99 11.02,43.13 12.55,44.66 12.55,49.59 13.55,50.59 IC1.17
RX
  Bottom 0.5: IC1.1 39.17,45.46 46.37,45.46 49.14,48.23 52.98,48.23 54.45,46.76 54.45,43.39 55.41,42.43 59.21,42.43 60.81,44.03 60.81,47.34 61.43,47.96 66.35,47.96 67.56,46.75 67.56,7.01 64.84,4.29 JP3.4
S0  (1 unrouted)
  Bottom 0.5: 25.48,52.19 IC1.19 | R3.1 15.37,72.97 | 15.37,72.97 15.37,72.73 | 25.82,52.19 4.36,52.19 3.47,53.08 3.47,56.29 5.26,58.08 8.06,58.08 16.84,66.86 20.27,66.86 21.45,65.68 24.82,65.68 25.53,66.39 JP1.8 25.5,67.33 20.7,72.13 16.21,72.13 15.37,72.97
S1
  Bottom 0.5: JP1.7 28.07,66.06 | JP1.7 28.07,68.19 25.95,70.31 24.31,70.31 20.74,73.88 R4.1 | JP1.7 28.07,65.89 24.99,62.81 23.97,62.81 20.38,59.22 20.38,54.87 22.26,52.99 IC1.20
S2
  Bottom 0.5: R5.1 32.61,70.85 30.72,68.96 30.72,67.22 | 30.72,67.22 JP1.6 | 30.61,66.04 JP1.6 | JP1.6 30.61,66.27 | 30.72,67.22 30.72,66.23 24.97,60.48 23.26,60.48 21.65,58.87 21.65,55.48 22.93,54.2 | 22.93,54.2 22.96,54.2 | 22.93,54.2 23.34,53.79 IC1.21
S3
  Bottom 0.5: JP1.5 | 33.15,65.94 JP1.5 | 28.08,54.59 IC1.22 24.27,54.59 22.96,55.9 22.96,58.24 23.71,58.99 25.22,58.99 33.15,66.92 JP1.5 | JP1.5 33.15,68.54 34.96,70.35 34.96,72.32 R7.1 | JP1.5 33.15,66.28 | JP1.5 33.15,65.93
S4
  Bottom 0.5: JP1.4 35.69,66.73 | IC1.24 31.3,57.51 30.63,58.18 29.22,58.18 28.17,59.23 28.17,60.28 31.82,63.93 33.96,63.93 35.69,65.66 JP1.4 | R9.1 37.5,70.67 35.69,68.86 JP1.4 | JP1.4 35.69,66.28
S5  (via drill 0.7 pad 2)
  Top 0.5: v40.67,43.28 40.4,43.55 40.4,46.49 32.07,54.82 32.07,58.97 v30.92,60.12
  Bottom 0.5: IC1.25 32.1,58.94 v30.92,60.12
  Bottom 0.7: v40.67,43.28 40.76,43.19 40.76,42.51 43.09,40.18 48.12,40.18 52.4,35.9 R12.2
S6  (via drill 0.61 pad 2, 0.7 pad 2)
  Top 0.5: v33.15,62.04 32.09,63.09 30.79,63.09 28.49,60.79 28.49,58.74 30.3,56.93 30.3,51.82 | 30.3,51.82 30.3,49.13 38.18,41.25 42.62,41.25 v43.94,42.57 | v51.16,40.27 52.56,38.87 52.56,34.44 48.39,30.27 v47.74,30.27 44.8,30.27 39.74,35.33 27.66,35.33 23.66,31.33 23.66,27.36 26.88,24.14 v26.88,16.98 | 30.3,51.82 24.52,46.04 v23.22,46.04
  Bottom 0.5: v33.15,62.04 32.9,61.79 IC1.26 | v43.94,42.57 44.4,42.11 48.04,42.11 49.88,40.27 v51.16,40.27 | 47.74,30.17 v47.74,30.27 | v23.22,46.04 22.68,45.5 22.68,43.14 19.68,40.14 C8.2 | R14.1 v26.87,16.97 v26.88,16.98
TX
  Bottom 0.5: IC1.44 45.49,46.59 48.32,49.42 53.54,49.42 55.7,47.26 55.7,44.36 56.49,43.57 58.71,43.57 59.63,44.49 59.63,48.26 60.81,49.44 67.99,49.44 68.7,48.73 68.7,4.23 JP3.5
VPOWER  (via drill 0.61 pad 2)
  Top 0.7: v30.28,20.15 29.07,21.36 D2.C 29.07,27.51 D1.C 29.12,30.32 D6.C D5.C
  Bottom 0.7: U1.6 25.77,33.66 23,30.9 23,25.08 27.1,20.98 29.45,20.98 v30.28,20.15 30.33,20.15 31.02,19.46 31.02,15.91 26.65,11.54 26.65,4.18 25.3,2.83 22.16,2.83 21.36,3.63 21.36,5.64 | IC2.1 21.53,14.18 22.85,12.86 22.85,8.01 21.36,6.52 21.36,5.64 | IC2.1 14.98,14.09 14.91,14.02 C2.1 | R8.2 15.03,14.18 IC2.1 | S1.2 13.2,4.03 14.81,5.64 21.36,5.64
VPREV
  Bottom 0.7: J1.P 31.83,4.59 28.49,1.25 18.15,1.25 16.63,2.77 S1.1
(copper drawn outside any net)
  shapes: Bottom area x957, Top area x898